# EAGLE board AI Camera V1.0 (EAGLE 9.6.2)
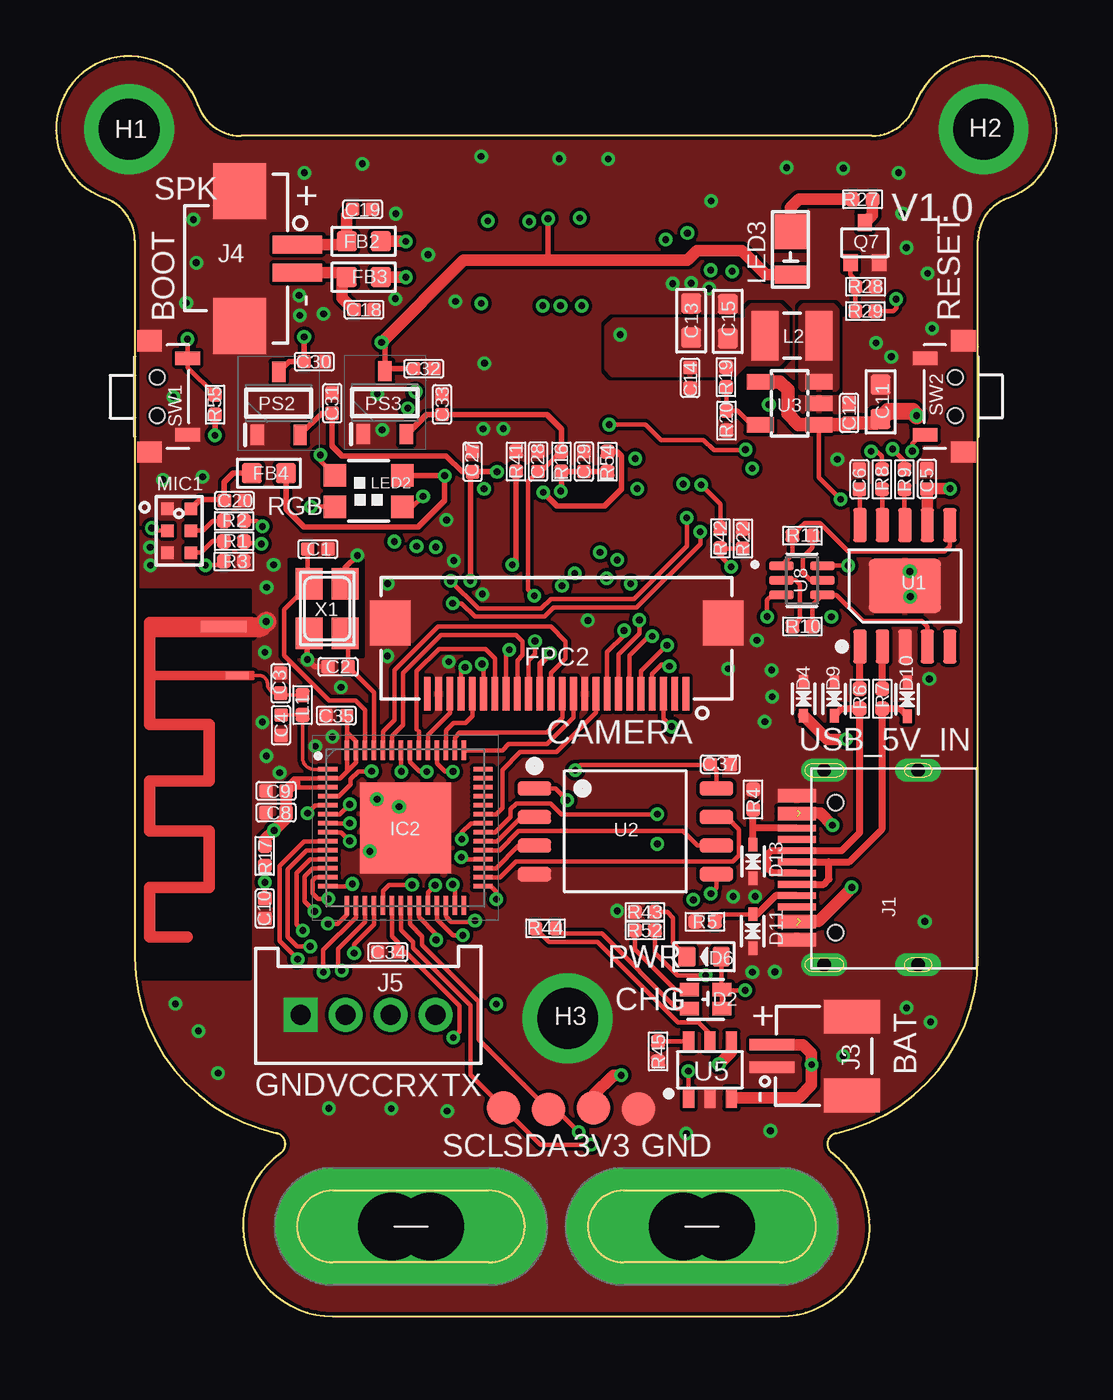
[diagram p2: board, top side]
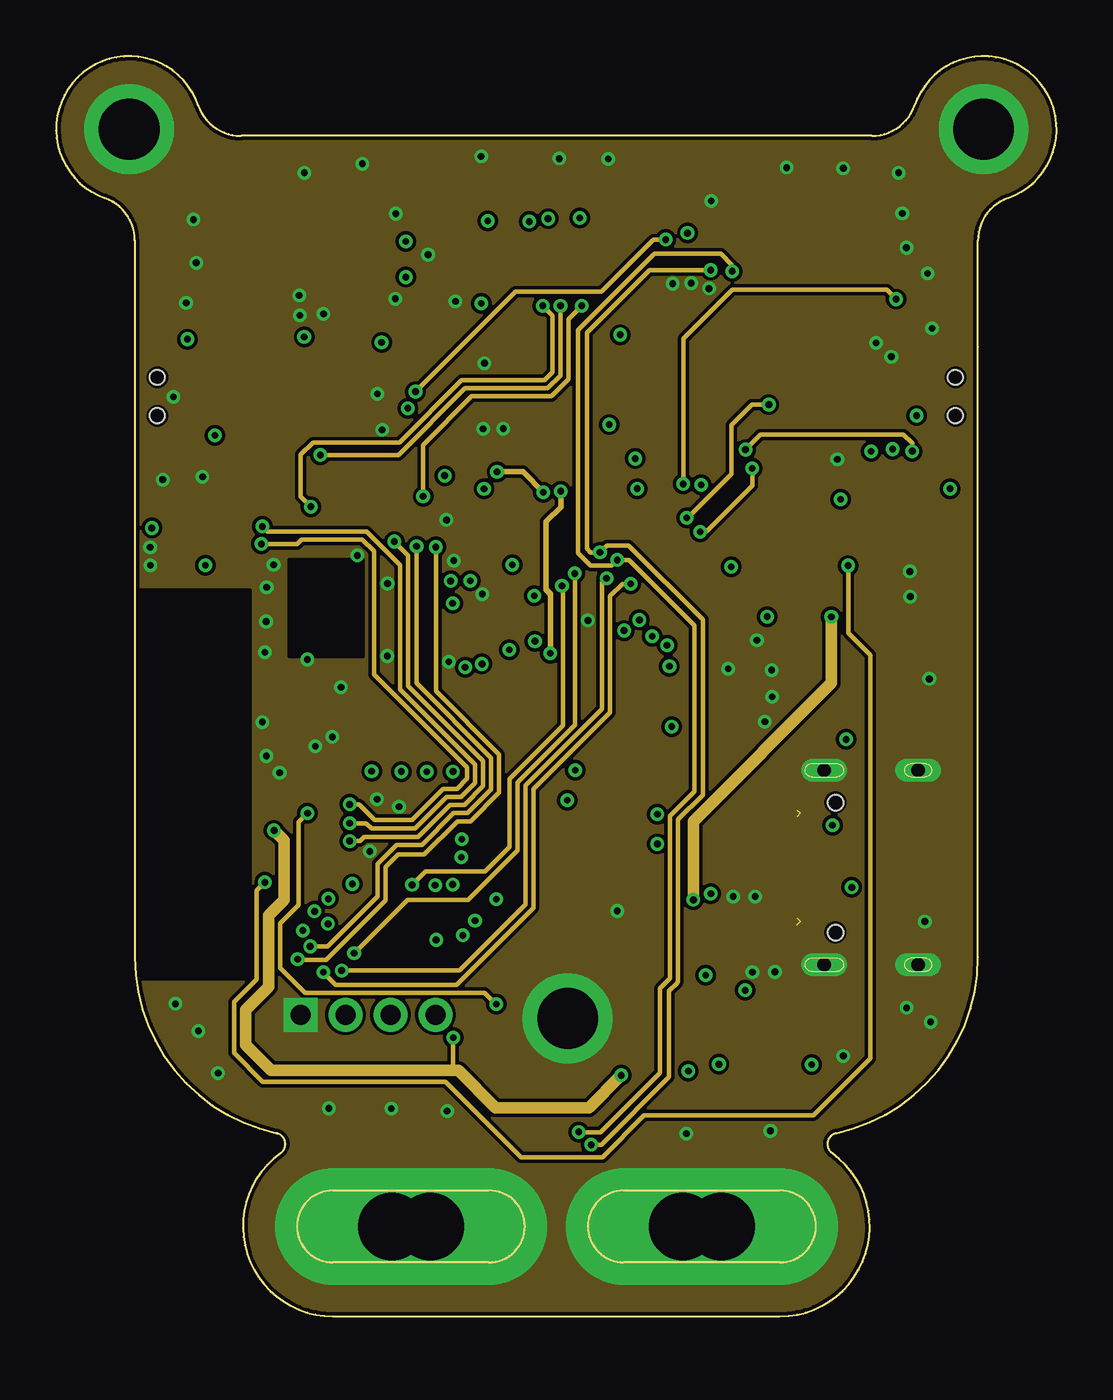
[diagram p3: board, inner layer Route2]
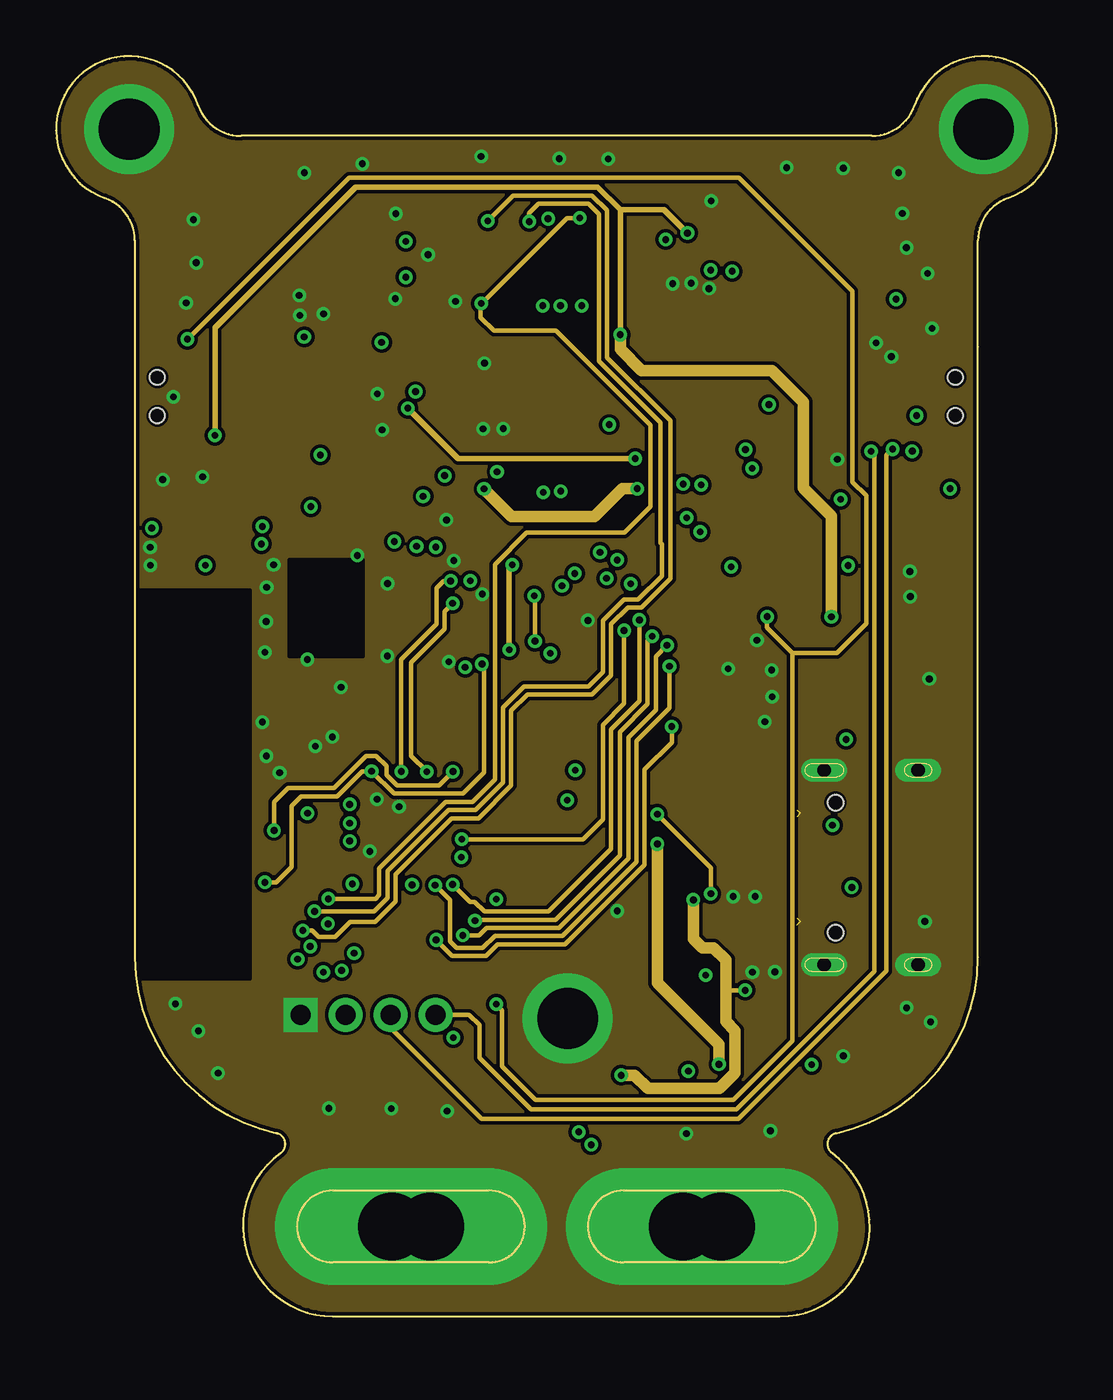
[diagram p4: board, inner layer Route15]
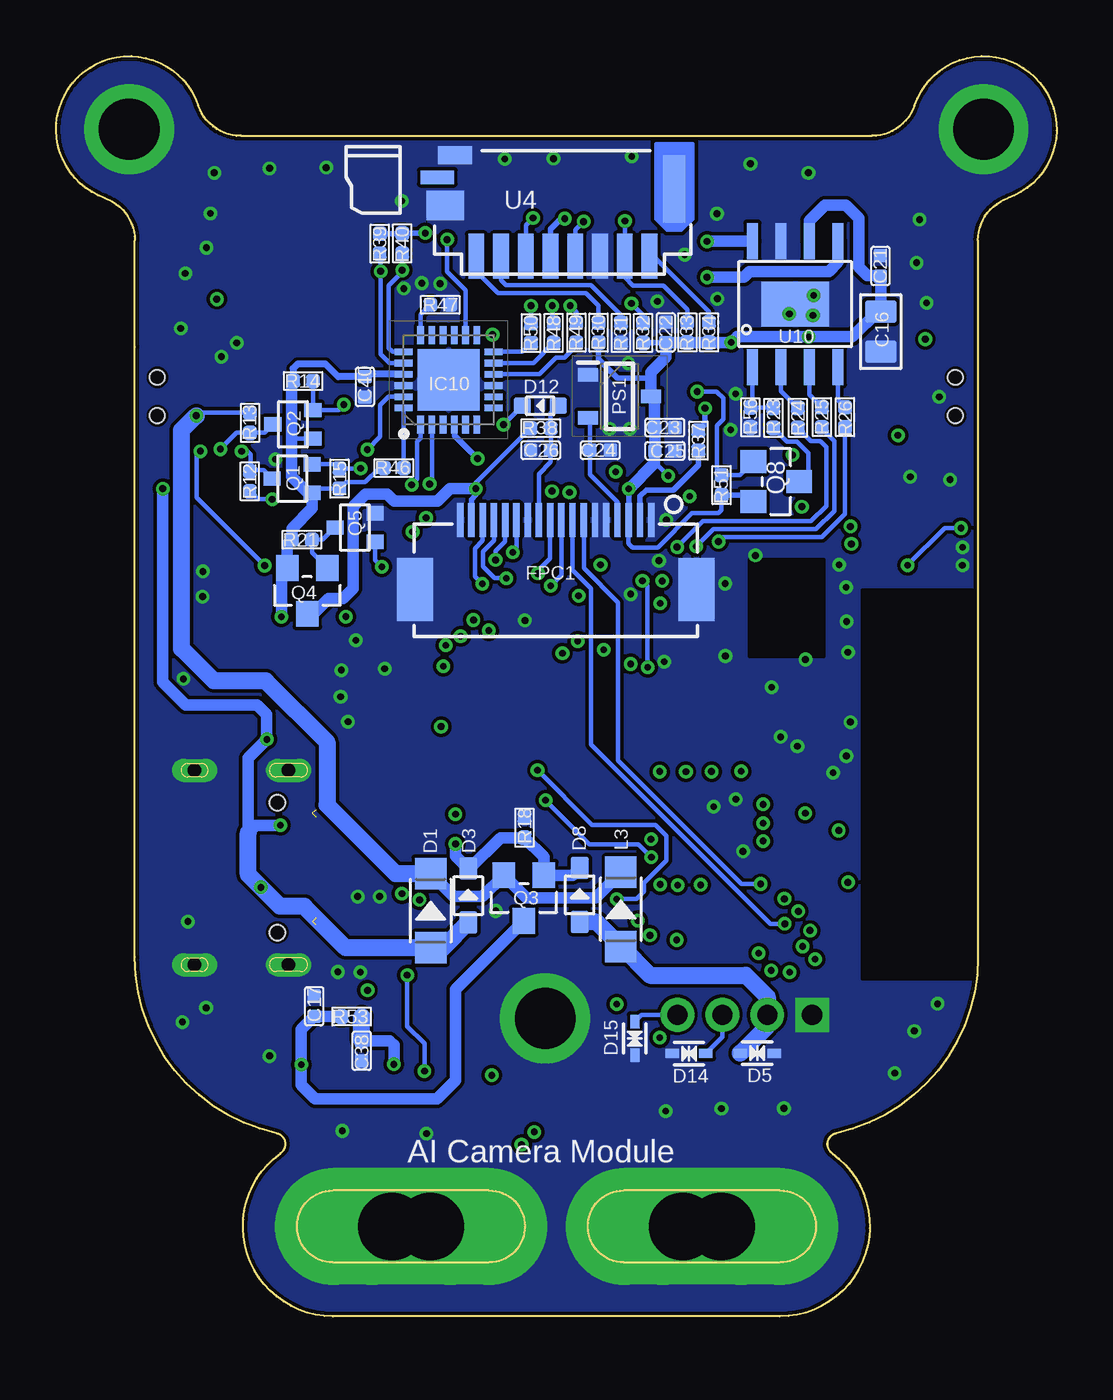
[diagram p5: board, bottom side, seen from below]

Size 44.5 x 56.05 mm. Coordinates in mm from the lower left corner, seen from the top.
Outline: 3.5,38.71 arc90 3.5,38.71
Outline: 3.5,43.11 arc90 3.5,43.11
Outline: 41,43.11 arc90 41,43.11
Outline: 12.31,0 32.19,0 arc144 34.52,7.25 arc-132 34.7,8.15 arc78 41,15.96 41,47.85 arc-71 42.33,49.73 arc232 38.18,53.85 arc-71 36.28,52.5 8.22,52.5 arc-71 6.32,53.85 arc232 2.17,49.73 arc-71 3.5,47.85 3.5,15.96 arc78 9.8,8.15 arc-132 9.98,7.25 arc144 12.31,0
Copper layers (1+2*15+16): Top 0.035mm / dielectric 1.5mm / Route2 0.035mm / dielectric 0.15mm / Route15 0.035mm / dielectric 0.2mm / Bottom 0.035mm
Design rules "default *": minimum track width 8mil, minimum drill 0.3mm, track to track 6mil, track to pad 6mil, pad to pad 4mil, via to via 6mil, smd to smd 6mil, copper to edge 6mil, drill to drill 4mil, minimum pad ring 6mil, minimum via ring 6mil, stop-mask expansion 4mil, vias tented up to drill 100mil, thermal gap 0mil

## Footprints (pad centres in the part's own frame; a part is rotated, then mirrored left to right if it is on the bottom)
ADAFRUIT_RN-ANT = smd 1 x 0.3: 1 0.5,2.159 | smd 2.032 x 0.508: GND 1.1,0
C0402 = smd 0.6 x 0.6: 1 -0.45,0; 2 0.45,0
C0603 = smd 0.889 x 0.889: 1 -0.762,0; 2 0.762,0
C0805 = smd 1.016 x 1.397: 1 -0.889,0; 2 0.889,0
D_SOD123FL = smd 1.397 x 1.397: + -1.651,0; - 1.651,0
LED_KT-0603RYG = smd 0.85 x 0.6: 1 0.725,-0.425; 2 0.725,0.425; 3 -0.725,-0.425; 4 -0.725,0.425
D_SOD323 = smd 1 x 0.8: + -1.2,0; - 1.2,0
SOD-523_L1.2-W0.8-LS1.6-BI = smd 0.6 x 0.4: 1 -0.75,0; 2 0.75,0
LED0603 = smd 0.762 x 0.889: + -0.762,0; - 0.762,0
D_SOD523 = smd 0.762 x 0.7: + -0.8,0; - 0.8,0
L0603 = smd 0.889 x 0.889: 1 -0.762,0; 2 0.762,0
FPC-SMD_18P-P0.50_ZX-0.5FPC-2H-HFJ18P = smd 0.28 x 1.5: 1 4.25,1.54; 2 3.75,1.54; 3 3.25,1.54; 4 2.75,1.54; 5 2.25,1.54; 6 1.75,1.54; 7 1.25,1.54; 8 0.75,1.54; 9 0.25,1.54; 10 -0.25,1.54; 11 -0.75,1.54; 12 -1.25,1.54; 13 -1.75,1.54; 14 -2.25,1.54; 15 -2.75,1.54; 16 -3.25,1.54; 17 -3.75,1.54; 18 -4.25,1.54 | smd 1.6 x 2.8: 19 -6.25,-1.54; 20 6.25,-1.54
FPC-SMD_P0.50-24P_QCHF-SM-H2.0 = smd 0.3 x 1.5: 1 5.75,-1.574; 2 5.25,-1.574; 3 4.75,-1.574; 4 4.25,-1.574; 5 3.75,-1.574; 6 3.25,-1.574; 7 2.75,-1.574; 8 2.25,-1.574; 9 1.75,-1.574; 10 1.25,-1.574; 11 0.75,-1.574; 12 0.25,-1.574; 13 -0.25,-1.574; 14 -0.75,-1.574; 15 -1.25,-1.574; 16 -1.75,-1.574; 17 -2.25,-1.574; 18 -2.75,-1.574; 19 -3.25,-1.574; 20 -3.75,-1.574; 21 -4.25,-1.574; 22 -4.75,-1.574; 23 -5.25,-1.574; 24 -5.75,-1.574 | smd 1.8 x 2: 25 7.4,1.576; 26 -7.4,1.576
HOLE_M2 = drill 2.7 pad 4: 1 0,0
LONGSTRIPHOLE = drill 3 pad 5.2 long: 1 -0.86,0; 2 0.86,0
QFN40P700X700X90-57N = smd 0.85 x 0.2: 1 -3.45,2.6; 2 -3.45,2.2; 3 -3.45,1.8; 4 -3.45,1.4; 5 -3.45,1; 6 -3.45,0.6; 7 -3.45,0.2; 8 -3.45,-0.2; 9 -3.45,-0.6; 10 -3.45,-1; 11 -3.45,-1.4; 12 -3.45,-1.8; 13 -3.45,-2.2; 14 -3.45,-2.6; 29 3.45,-2.6; 30 3.45,-2.2; 31 3.45,-1.8; 32 3.45,-1.4; 33 3.45,-1; 34 3.45,-0.6; 35 3.45,-0.2; 36 3.45,0.2; 37 3.45,0.6; 38 3.45,1; 39 3.45,1.4; 40 3.45,1.8; 41 3.45,2.2; 42 3.45,2.6 | smd 0.2 x 0.85: 15 -2.6,-3.45; 16 -2.2,-3.45; 17 -1.8,-3.45; 18 -1.4,-3.45; 19 -1,-3.45; 20 -0.6,-3.45; 21 -0.2,-3.45; 22 0.2,-3.45; 23 0.6,-3.45; 24 1,-3.45; 25 1.4,-3.45; 26 1.8,-3.45; 27 2.2,-3.45; 28 2.6,-3.45; 43 2.6,3.45; 44 2.2,3.45; 45 1.8,3.45; 46 1.4,3.45; 47 1,3.45; 48 0.6,3.45; 49 0.2,3.45; 50 -0.2,3.45; 51 -0.6,3.45; 52 -1,3.45; 53 -1.4,3.45; 54 -1.8,3.45; 55 -2.2,3.45; 56 -2.6,3.45 | smd 4.05 x 4.05: 57 0,0
QFN50P400X400X80-25N = smd 0.8 x 0.3: 1 -2,1.25; 2 -2,0.75; 3 -2,0.25; 4 -2,-0.25; 5 -2,-0.75; 6 -2,-1.25; 13 2,-1.25; 14 2,-0.75; 15 2,-0.25; 16 2,0.25; 17 2,0.75; 18 2,1.25 | smd 0.3 x 0.8: 7 -1.25,-2; 8 -0.75,-2; 9 -0.25,-2; 10 0.25,-2; 11 0.75,-2; 12 1.25,-2; 19 1.25,2; 20 0.75,2; 21 0.25,2; 22 -0.25,2; 23 -0.75,2; 24 -1.25,2 | smd 2.75 x 2.75: 25 0,0
USB-3.0TYPEC-SMD = smd 0.3 x 1.7: A1 -3.35,0.5; A4 -2.55,0.5; A5 -1.25,0.5; A6 -0.25,0.5; A7 0.25,0.5; A8 1.25,0.5; A9 2.55,0.5; A12 3.35,0.5; B1 3.05,0.5; B4 2.25,0.5; B5 1.75,0.5; B6 0.75,0.5; B7 -0.75,0.5; B8 -1.75,0.5; B9 -2.25,0.5; B12 -3.05,0.5 | drill 0.6 pad 1.016 long: P$1 -4.325,-0.72; P$2 4.325,-0.72; P$3 -4.325,-4.9; P$4 4.325,-4.9 | hole 0.68: -2.89,-1.22; 2.89,-1.22
CONN-SMD_2P-P1.00_XUNPU_WAFER-SH1.0-2PWB = smd 0.5 x 2: 1 -0.5,1.85; 2 0.5,1.85 | smd 1.5 x 2.5: 3 1.75,-1.7; 4 -1.75,-1.7
CONN-SMD_2P-P1.25-HC-1.25-2PWT = smd 0.8 x 2.2: 1 -0.625,1.285; 2 0.625,1.285 | smd 2.5 x 2.35: 3 -3.005,-1.285; 4 3.005,-1.285
CONN-TH_4P-P2.00_HCTL_HC-HY-4A = drill 0.9 pad 1.5 square: 1 3,0 | drill 0.9 pad 1.5: 2 1,0; 3 -1,0; 4 -3,0
L0402 = smd 0.635 x 0.635: 1 -0.445,0; 2 0.445,0
IND-SMD_L2.5-W2.0_MHCHL2520 = smd 1.2 x 2.2: 1 -1.2,0; 2 1.2,0
LED-SMD_4P-L3.2-W2.7-BL_A-SP1553R6GHB1C-A01-2T = smd 1 x 1: 1 -1.5,-0.7; 2 -1.5,0.7; 3 1.5,0.7; 4 1.5,-0.7
LED_3014_SMT = smd 0.8 x 1.4: 1 1.085,0 | smd 1.57 x 1.4: 2 -0.83,0
MIC-SMD_6P-L2.8-W1.9-P0.98-TL = smd 0.55 x 0.55: 1 -0.525,0.98; 2 -0.525,0; 3 -0.525,-0.98; 4 0.525,0.98; 5 0.525,0; 6 0.525,-0.98
TEST_PAD-1.5MM = smd 1.5 x 1.5: P$1 0,0
SOT95P280X130-3N = smd 0.9 x 0.6: 1 -1.4,0.95; 2 -1.4,-0.95; 3 1.4,0
MOS_SOT323 = smd 0.635 x 0.762: 1 -0.635,-0.889; 2 0.635,-0.889; 3 0,0.889
PMOS_SOT23 = smd 1.016 x 1.143: 1 -0.889,-1.016; 2 0.889,-1.016; 3 0,1.016
R0402 = smd 0.635 x 0.635: 1 -0.445,0; 2 0.445,0
KEY-SMD_4P-L4.6-W2.4_TSC01A-TDW1FH3.5 = smd 0.6 x 1.1: 1 -1.7,-0.85; 2 1.7,-0.85 | smd 0.95 x 1.1: 3 2.475,0.85; 4 -2.475,0.85 | hole 0.65: 0.85,0.5; -0.85,0.5
ESOP-10-EP-150MIL = smd 1.5 x 0.6: 1 -2.7,2; 2 -2.7,1; 3 -2.7,0; 4 -2.7,-1; 5 -2.7,-2; 6 2.7,-2; 7 2.7,-1; 8 2.7,0; 9 2.7,1; 10 2.7,2 | smd 2.4 x 3.2: EP 0,0
CKP_W25QXX-SOP-8-208MIL = smd 1.5 x 0.635: 1 -4.05,1.905; 2 -4.05,0.635; 3 -4.05,-0.635; 4 -4.05,-1.905; 5 4.05,-1.905; 6 4.05,-0.635; 7 4.05,0.635; 8 4.05,1.905
IC_SOT23-5 = smd 0.69 x 1.2: 1 -0.95,-1.3; 2 0,-1.3; 3 0.95,-1.3; 4 0.95,1.3; 5 -0.95,1.3
TF-SMD_HYCW104-TF08-375B = smd 0.7 x 2: 1 -3.53,-2.45; 2 -2.43,-2.45; 3 -1.33,-2.45; 4 -0.23,-2.45; 5 0.87,-2.45; 6 1.97,-2.45; 7 3.07,-2.45; 8 4.17,-2.45 | smd 1.5 x 0.6: 9 -5.27,1.06 | smd 1.5 x 0.8: 10 -4.48,2.05 | smd 1.65 x 1.3: 11 -4.91,-0.19 | smd 1 x 3: 12 5.27,0.55
SOT23-6L = smd 0.5 x 0.9: 1 -0.961,-1.212; 2 -0.011,-1.212; 3 0.94,-1.212; 4 0.94,1.288; 5 -0.011,1.288; 6 -0.961,1.288
SOP65P210X100-6N = smd 1.09 x 0.4: 1 -0.92,0.65; 2 -0.92,0; 3 -0.92,-0.65; 4 0.92,-0.65; 5 0.92,0; 6 0.92,0.65
NS4168-ESOP-8 = smd 1.6 x 0.5: 1 -2.8,1.905; 2 -2.8,0.635; 3 -2.8,-0.635; 4 -2.8,-1.905; 5 2.8,-1.905; 6 2.8,-0.635; 7 2.8,0.635; 8 2.8,1.905 | smd 2 x 3: 9 0,0
ADAFRUIT_NX3225 = smd 1.4 x 1.2: 1 -1.1,-0.8; 2 1.1,-0.8; 3 1.1,0.8; 4 -1.1,0.8

## Placement (x,y rotation side)
ANT1  ADAFRUIT_ANTENNA  [ADAFRUIT_RN-ANT]  8.56,30.66 180 top
C1  12pF  [C0402]  11.64,34.12 180 top
C2  12pF  [C0402]  12.54,28.89 0 top
C3  NC  [C0402]  9.98,28.16 90 top
C4  NC  [C0402]  10,26.29 270 top
C5  100nF  [C0402]  38.73,37.25 90 top
C6  1uF  [C0402]  35.73,37.23 90 top
C8  10uF  [C0402]  9.78,22.4 180 top
C9  100nF  [C0402]  9.78,23.37 0 top
C10  100nF  [C0402]  9.28,18.14 90 top
C11  22uF  [C0603]  36.67,40.67 270 top
C12  100nF  [C0402]  35.27,40.18 90 top
C13  22uF  [C0603]  28.24,44.28 270 top
C14  100nF  [C0402]  28.2,41.74 270 top
C15  22uF  [C0603]  29.87,44.25 270 top
C16  47uF  [C0805]  7.82,43.8 270 bottom
C17  10uF  [C0402]  33.02,13.79 270 bottom
C18  1nF/NC  [C0402]  13.69,44.77 180 top
C19  1nF/NC  [C0402]  13.63,49.24 0 top
C20  100nF  [C0402]  7.93,36.28 0 top
C21  100nF  [C0402]  7.84,46.72 90 bottom
C22  1uF  [C0402]  17.38,43.76 270 bottom
C23  1uF  [C0402]  17.43,39.53 0 bottom
C24  1uF  [C0402]  20.3,38.52 0 bottom
C25  100nF  [C0402]  17.42,38.49 180 bottom
C26  1uF  [C0402]  22.95,38.52 0 bottom
C27  100nF  [C0402]  18.52,38.01 90 top
C28  100nF  [C0402]  21.44,38.02 90 top
C29  100nF  [C0402]  23.47,38.02 90 top
C30  1uF  [C0402]  11.48,42.46 0 top
C31  1uF  [C0402]  12.28,40.61 90 top
C32  1uF  [C0402]  16.35,42.15 0 top
C33  1uF  [C0402]  17.16,40.56 90 top
C34  100nF  [C0402]  14.75,16.2 0 top
C35  100nF  [C0402]  12.46,26.72 180 top
C37  100nF  [C0402]  29.54,24.55 180 top
C38  1uF  [C0402]  30.91,11.81 90 bottom
C40  100nF  [C0402]  30.77,41.34 90 bottom
D1  DSS34  [D_SOD123FL]  27.84,18.04 90 bottom
D2  KT-0603RYG  [LED_KT-0603RYG]  28.89,14.1 0 top
D3  1N5817WS  [D_SOD323]  26.17,18.71 90 bottom
D4  LESD5D5.0CT1G-ES  [SOD-523_L1.2-W0.8-LS1.6-BI]  33.24,27.47 270 top
D5  LESD5D5.0CT1G-ES  [SOD-523_L1.2-W0.8-LS1.6-BI]  13.32,11.7 180 bottom
D6  Red  [LED0603]  28.82,15.99 180 top
D8  1N5817WS  [D_SOD323]  21.22,18.74 90 bottom
D9  LESD5D5.0CT1G-ES  [SOD-523_L1.2-W0.8-LS1.6-BI]  34.61,27.46 270 top
D10  LESD5D5.0CT1G-ES  [SOD-523_L1.2-W0.8-LS1.6-BI]  37.85,27.45 270 top
D11  LESD5D5.0CT1G-ES  [SOD-523_L1.2-W0.8-LS1.6-BI]  30.99,17.13 90 top
D12  B5819WT  [D_SOD523]  22.97,40.5 180 bottom
D13  LESD5D5.0CT1G-ES  [SOD-523_L1.2-W0.8-LS1.6-BI]  31,20.23 90 top
D14  LESD5D5.0CT1G-ES  [SOD-523_L1.2-W0.8-LS1.6-BI]  16.35,11.69 0 bottom
D15  LESD5D5.0CT1G-ES  [SOD-523_L1.2-W0.8-LS1.6-BI]  18.76,12.36 90 bottom
FB2  1K/500mA  [L0603]  13.68,47.81 180 top
FB3  1K/500mA  [L0603]  13.68,46.22 180 top
FB4  0R/800mA  [L0603]  9.46,37.5 0 top
FPC1  ZX-0.5FPC-2H-HFJ18P  [FPC-SMD_18P-P0.50_ZX-0.5FPC-2H-HFJ18P]  22.28,33.87 0 bottom
FPC2  AFC24-S24FIA-00  [FPC-SMD_P0.50-24P_QCHF-SM-H2.0]  22.26,29.26 0 top
H1  HOLE  [HOLE_M2]  3.25,52.8 0 top
H2  HOLE  [HOLE_M2]  41.25,52.8 0 top
H3  HOLE  [HOLE_M2]  22.75,13.25 0 top
H4  HOLE1  [LONGSTRIPHOLE]  15.78,4 0 top
H5  HOLE1  [LONGSTRIPHOLE]  28.72,4 0 top
IC2  ESP32-S3R8  [QFN40P700X700X90-57N]  15.53,21.72 0 top
IC10  AW9523BTQR  [QFN50P400X400X80-25N]  27.04,41.65 90 bottom
J1  TYPEC-3.0-16P-SMD  [USB-3.0TYPEC-SMD]  33.44,19.96 90 top
J3  ZX-SH1.0-2PLT1  [CONN-SMD_2P-P1.00_XUNPU_WAFER-SH1.0-2PWB]  33.69,11.58 90 top
J4  HC-1.25-2PWT  [CONN-SMD_2P-P1.25-HC-1.25-2PWT]  9.45,47.04 270 top
J5  HC-HY-4A-M  [CONN-TH_4P-P2.00_HCTL_HC-HY-4A]  13.87,13.41 180 top
L1  0R  [L0402]  10.96,27.19 270 top
L2  FTC252012S2R2MBCA  [IND-SMD_L2.5-W2.0_MHCHL2520]  32.73,43.61 180 top
L3  C15957_100Ω@100MHz  [D_SOD123FL]  19.38,18.1 90 bottom
LED2  A-SP1553R6GHB1C-A01-2T  [LED-SMD_4P-L3.2-W2.7-BL_A-SP1553R6GHB1C-A01-2T]  13.9,36.71 0 top
LED3  3014_LED  [LED_3014_SMT]  32.66,47.41 270 top
MIC1  LMD2718T261-OA1  [MIC-SMD_6P-L2.8-W1.9-P0.98-TL]  5.47,34.94 0 top
P1  TEST_PADPAD-1.5MM  [TEST_PAD-1.5MM]  23.9,9.28 180 top
P2  TEST_PADPAD-1.5MM  [TEST_PAD-1.5MM]  25.9,9.22 180 top
P3  TEST_PADPAD-1.5MM  [TEST_PAD-1.5MM]  21.9,9.21 180 top
P4  TEST_PADPAD-1.5MM  [TEST_PAD-1.5MM]  19.9,9.27 180 top
PS1  XC6206P182MR  [SOT95P280X130-3N]  19.44,40.92 0 bottom
PS2  XC6206P282MR  [SOT95P280X130-3N]  9.9,40.61 90 top
PS3  XC6206P182MR  [SOT95P280X130-3N]  14.62,40.64 90 top
Q1  BSS138W_SOT323  [MOS_SOT323]  34,37.26 90 bottom
Q2  BSS138W_SOT323  [MOS_SOT323]  33.97,39.67 90 bottom
Q3  AO3401  [PMOS_SOT23]  23.7,18.6 180 bottom
Q4  AO3401  [PMOS_SOT23]  33.33,32.26 180 bottom
Q5  SS8050W-SOT323  [MOS_SOT323]  31.21,35.08 90 bottom
Q7  SS8050W-SOT323  [MOS_SOT323]  35.97,47.75 0 top
Q8  AO3401  [PMOS_SOT23]  12.47,37.13 270 bottom
R1  0R  [R0402]  7.91,34.47 0 top
R2  0R  [R0402]  7.91,35.38 0 top
R3  NC  [R0402]  7.9,33.58 0 top
R4  5.1K  [R0402]  31,22.99 90 top
R5  5.1K  [R0402]  28.86,17.55 180 top
R6  0R  [R0402]  35.74,27.47 270 top
R7  0R  [R0402]  36.74,27.47 270 top
R8  0R  [R0402]  36.73,37.23 270 top
R9  0R  [R0402]  37.73,37.23 270 top
R10  10K  [R0402]  33.19,30.68 0 top
R11  10K  [R0402]  33.19,34.72 180 top
R12  4.7K  [R0402]  35.89,37.14 90 bottom
R13  4.7K  [R0402]  35.88,39.74 270 bottom
R14  4.7K  [R0402]  33.52,41.6 0 bottom
R15  4.7K  [R0402]  31.9,37.26 90 bottom
R16  0R  [R0402]  22.47,38.02 90 top
R17  10K  [R0402]  9.28,20.48 270 top
R18  10K  [R0402]  23.67,21.73 90 bottom
R19  45.3K  [R0402]  29.8,41.77 270 top
R20  10K  [R0402]  29.82,39.84 270 top
R21  10K  [R0402]  33.57,34.54 180 bottom
R22  10K  [R0402]  30.54,34.59 90 top
R23  1K  [R0402]  12.6,39.96 270 bottom
R24  0R  [R0402]  11.51,39.96 270 bottom
R25  0R  [R0402]  10.44,39.99 270 bottom
R26  0R  [R0402]  9.41,39.99 270 bottom
R27  100R  [R0402]  35.87,49.68 180 top
R28  10K  [R0402]  36,45.79 0 top
R29  100R  [R0402]  35.99,44.71 180 top
R30  10K  [R0402]  20.37,43.75 270 bottom
R31  10K  [R0402]  19.38,43.74 270 bottom
R32  10K  [R0402]  18.39,43.74 270 bottom
R33  10K  [R0402]  16.43,43.76 270 bottom
R34  10K  [R0402]  15.46,43.76 270 bottom
R37  0R  [R0402]  15.93,38.95 270 bottom
R38  10K  [R0402]  22.95,39.5 180 bottom
R39  4.7K  [R0402]  30.11,47.71 270 bottom
R40  4.7K  [R0402]  29.11,47.72 270 bottom
R41  1K  [R0402]  20.46,38.02 90 top
R42  100R  [R0402]  29.54,34.6 270 top
R43  5.1K  [R0402]  26.19,17.98 180 top
R44  2K  [R0402]  21.76,17.26 0 top
R45  2K  [R0402]  26.77,11.78 90 top
R46  0R  [R0402]  29.48,37.73 0 bottom
R47  0R  [R0402]  27.41,44.99 0 bottom
R48  1K  [R0402]  22.37,43.74 90 bottom
R49  1K  [R0402]  21.36,43.75 90 bottom
R50  1K  [R0402]  23.38,43.73 90 bottom
R51  10K  [R0402]  14.9,36.97 270 bottom
R52  5.1K  [R0402]  26.19,17.17 180 top
R53  5.1K  [R0402]  31.36,13.33 0 bottom
R54  0R/NC  [R0402]  24.52,38.01 90 top
R55  10K  [R0402]  7.06,40.55 90 top
R56  100K  [R0402]  13.62,39.98 90 bottom
SW1  TSC01A-TDW1EH3.5  [KEY-SMD_4P-L4.6-W2.4_TSC01A-TDW1FH3.5]  5,40.91 90 top
SW2  TSC01A-TDW1EH3.5  [KEY-SMD_4P-L4.6-W2.4_TSC01A-TDW1FH3.5]  39.5,40.91 270 top
U1  CH340K  [ESOP-10-EP-150MIL]  37.75,32.49 90 top
U2  W25Q128JVSIQ  [CKP_W25QXX-SOP-8-208MIL]  25.32,21.57 0 top
U3  RY3430  [IC_SOT23-5]  32.62,40.61 90 top
U4  TF-027-H300  [TF-SMD_HYCW104-TF08-375B]  22.28,49.6 0 bottom
U5  TP4059-SOT23-6  [SOT23-6L]  29.09,10.93 0 top
U8  UMH3NTN  [SOP65P210X100-6N]  33.17,32.74 0 top
U10  NS4168-ESOP-8  [NS4168-ESOP-8]  11.63,45.02 90 bottom
X1  40MHz(10ppm)  [ADAFRUIT_NX3225]  12.06,31.47 270 top

## Tracks (layer width: path | path; a pad name or v marks a point on that pad's centre or on a via)
1V8
  Bottom 0.203: FPC1.4 19.53,36.22 20.75,37.44 C24.1 20.75,39.88 PS1.2
3V3  (via drill 0.3)
  Top 0.254: 10.21,37.51 FB4.2 10.22,35.9 11.02,35.1 16.09,35.1 17.28,36.29 v17.28,37.39 15.42,37.39 LED2.3 15.1,37.71 | PS2.3 10.35,42.46 C30.1 v11.03,43.56 | C32.1 14.73,42.15 PS3.3 14.62,43.17 v14.47,43.32 | v21.88,48.82 21.88,46.98 21.87,46.97
  Top 0.508: 14.58,42 PS3.3 | C32.1 | LED3.1 31.57,46.32 30.51,47.39 28.5,47.39 28.08,46.97 21.87,46.97 18.13,46.97 v14.47,43.32
  Route15 0.508: v25.84,36.81 25.19,36.81 23.95,35.57 20.26,35.57 v19.03,36.8
  Bottom 0.203: v25.84,36.81 25.84,37.05 R38.2 | v17.28,37.39 17.84,37.95 17.88,37.95 | 19.03,35.68 19.04,35.67 19.04,34.38 18.86,34.2 17.74,34.2 16.21,35.73 15.04,35.73 14.9,35.87 R51.2
  Bottom 0.254: FPC1.3 19.03,35.68 v19.03,36.8 19.03,36.83 | C25.2 | 17.88,40.76 PS1.3 | FPC1.17 26.03,36.33 25.84,36.52 v25.84,36.81 | Q8.2 13.77,36.53 R51.2 | R30.2 20.37,42.57 19.53,41.73 18.04,41.73 | R32.2 17.39,43.29 C22.2 | U4.4 22.51,48.35 22.04,48.82 v21.88,48.82
  Bottom 0.381: R33.2
  Bottom 0.508: C22.2 17.37,42.67 18.04,42 18.04,41.73 PS1.3 | C22.2 17.4,43.32 | U10.6 10.99,48.72 10.3,49.42 9.37,49.42 8.79,48.84 8.79,46.66 8.41,46.28 C21.1 7.82,46.25 C16.1 7.95,44.69 9.07,43.56 v11.03,43.56 v11.03,43.57 14.22,43.57 v14.47,43.32 R34.2 R33.2 C22.2 | Q4.3 33.08,31.24 32.39,31.93 31.73,31.93 31.3,32.36 31.3,36.01 30.73,36.58 29.78,36.58 29.46,36.26 27.53,36.26 26.98,36.81 v25.84,36.81 | v19.03,36.8 17.88,37.95 C25.2 | C25.2 C23.1 17.88,40.76
3V3_1  (via drill 0.3)
  Top 0.203: 10.79,23.92 IC2.2 12.63,23.92 12.96,24.26 | 10.79,23.92 10.59,23.92 | 10.59,23.92 10.58,23.92 10.39,23.73 | 10.39,23.73 10.23,23.57 C9.2 | IC2.3 10.76,23.52 | 10.76,23.52 10.61,23.52 | 10.61,23.52 10.38,23.52 C9.2 | 10.79,23.92 10.76,23.89 10.76,23.69 | 10.76,23.69 10.76,23.67 | 10.76,23.67 10.76,23.52 | 10.59,23.92 10.61,23.9 10.61,23.52 | 10.76,23.69 10.44,23.69 10.39,23.73 | C9.2 10.46,23.37 10.76,23.67 | 12.96,24.26 13.33,24.63 IC2.55 13.33,25.56 12.93,25.96 | 12.96,24.26 12.93,24.28 IC2.56 12.93,25.96 | v17.65,24.23 17.3,24.23 16.93,24.59 IC2.46 | D2.2 29.58,14.56 D6.+ | D2.2 D2.1 | IC2.20 14.93,16.9 15.2,16.64 C34.2 15.55,16.2 17.94,13.81 17.94,12.67 v17.66,12.39 | D2.2 29.64,14.5 v30.65,14.5 | 12.93,25.96 12.93,26.69 C35.1
  Top 0.254: v7.06,39.18 R55.1
  Top 0.508: R17.1 9.28,21.2 v9.69,21.61 10.23,22.15 C8.1 C9.2 | D6.+ 29.61,15.96 | v25.13,10.72 24.78,10.72 23.9,9.84 P1.P$1
  Route2 0.203: 17.5,10.94 17.46,10.98 17.66,11.18 v17.66,12.39
  Route2 0.508: v9.69,21.61 10.14,21.16 10.14,18.52 9.45,17.83 9.45,14.65 8.42,13.62 8.42,12.08 9.56,10.94 17.5,10.94 17.89,10.94 19.55,9.28 23.69,9.28 v25.13,10.72 | v28.34,18.52 28.34,22.02 34.48,28.16 v34.48,31.11
  Route15 0.203: v9.69,21.61 9.69,22.87 10.31,23.49 12.36,23.49 13.79,24.92 14.24,24.92 14.69,24.47 14.69,24.08 15.17,23.61 17.03,23.61 v17.65,24.23 | v30.65,14.5 29.78,14.5
  Route15 0.254: v25.09,43.66 25.09,49.22 | v7.06,39.18 7.06,43.98 13.31,50.23 24.08,50.23 25.09,49.22 | v28.08,48.18 27.04,49.22 25.09,49.22
  Route15 0.508: v28.34,18.52 28.34,16.79 28.74,16.39 29.24,16.39 29.78,15.85 29.78,14.5 29.78,13.11 30.19,12.7 30.19,10.82 29.51,10.14 26.31,10.14 25.73,10.72 v25.13,10.72 | v34.48,31.11 34.48,35.59 33.24,36.84 33.24,40.66 31.84,42.06 26.04,42.06 25.09,43.01 v25.09,43.66
  Bottom 0.203: Q2.1 34.01,39.03 34.03,39.05 | 33.03,36.7 32.92,36.82 R15.1 31.61,37.1 30.75,37.1 30.12,37.73 R46.1
  Bottom 0.254: 32.04,36.67 R15.1 | 33.03,36.7 Q1.1 | R39.1 R40.1 28.1,48.16 v28.08,48.18
  Bottom 0.305: IC10.21 30.66,41.9 C40.2 31.95,41.79 32.52,42.36 33.76,42.36 33.96,42.16 R14.1
  Bottom 0.508: v34.48,31.11 34.48,33.01 Q4.2 34.22,34.33 R21.2 | R14.1 34.03,41.53 34.03,39.05 34.03,37.35 33.3,36.62 Q1.1 33.11,35.94 34.01,35.03 R21.2 | R21.2 33.99,34.56
  pour Top: 24.75,41.87 30.17,41.87 30.66,42.36 32.14,42.36 32.53,42.75 32.53,44.61 32.17,44.97 30.94,44.97 30.73,44.76 30.73,44.42 30.65,44.34 24.81,44.34 24.48,44.01 24.48,42.14
CAM_1V8  (via drill 0.3)
  Top 0.203: 21.5,37.57 C28.1 | 22.39,38.46 R16.2 22.15,38.15 22.14,38.15 21.56,37.57 C28.1 | FPC2.15 21.01,29.16 21.3,29.45 v21.3,30.03 | C28.1 20.99,37.12 20.99,32.32 v21.26,32.05
  Top 0.254: R16.2 22.47,39.47 21.83,40.11 C33.1 16.47,40.11 15.6,39.24 PS3.2
  Route15 0.203: v21.3,30.03 21.3,32.01 v21.26,32.05
CAM_2V8  (via drill 0.3)
  Top 0.203: FPC2.21 18.01,28.69 v18.19,28.87 | 18.52,37.49 C27.1
  Top 0.254: PS2.2 11.8,40.16 C31.1 12.28,38.7 12.71,38.27 17.35,38.27 18.06,37.56 C27.1 | R54.2 24.94,38.45 25.14,38.25 25.14,36.8 24.38,36.04 22.27,36.04 v21.67,36.64 | C27.1 18.42,37.46 v18.42,32.71 | v19.61,37.56 C27.1
  Route2 0.254: v19.61,37.56 20.75,37.56 v21.67,36.64
  Bottom 0.203: v18.42,32.71 18.19,32.48 v18.19,28.87
CC1
  Top 0.203: R5.1 29.63,17.88 D11.2
  Top 0.305: J1.A5 32,18.71 31.17,17.88 D11.2
CC2
  Top 0.305: D13.2 31,21.71 | 31,21.71 R4.1 | 31,21.71 J1.B5
DOVDD  (via drill 0.3)
  Top 0.203: C29.1 | R54.1
  Top 0.254: FPC2.14 21.51,29.02 v21.98,29.49 | v22.44,36.7 22.47,36.73 R16.1 C29.1 | C29.1 R54.1
  Route2 0.254: v21.98,29.49 21.98,32.13 21.79,32.32 21.79,35.35 22.44,36 v22.44,36.7
DTR
  Top 0.203: R10.2 33.63,31.63 U8.4 34.71,32.09 35.88,30.92 38.5,30.92 38.75,30.67 U1.4
ESP32_EN  (via drill 0.3)
  Top 0.203: C10.2 v9.28,19.3 R17.2 9.32,20.04 9.33,20.02 | v14.03,24.24 13.45,24.24 13.1,23.89 13.1,23.66 12.56,23.12 IC2.4 | U8.6 v35.23,33.39 | FPC2.19 19.01,28.94 v18.94,29.01 | v38.08,38.48 38.08,38.81 38.48,39.21 SW2.2 | v30.66,38.55 30.63,38.52 29.26,38.52 28.8,38.98 26.89,38.98 26.21,39.66 v24.6,39.66
  Route2 0.203: v35.23,33.39 35.23,30.39 36.21,29.41 36.21,11.47 33.67,8.93 26.15,8.93 24.29,7.07 20.68,7.07 17.32,10.43 9.19,10.43 7.91,11.71 7.91,13.98 8.91,14.98 8.91,18.93 v9.28,19.3 | v38.08,38.48 38.08,38.83 37.69,39.22 31.33,39.22 v30.66,38.55
  Route15 0.203: v9.28,19.3 9.78,19.3 10.47,19.99 10.47,22.69 10.9,23.12 12.49,23.12 13.61,24.24 v14.03,24.24 15.02,23.25 18.09,23.25 19.02,24.18 19.02,28.93 v18.94,29.01
  Bottom 0.203: 23.63,40.64 D12.- v24.6,39.66 | v38.08,38.48 38.25,38.48 38.25,36.41 v35.23,33.39 | v30.66,38.55 30.09,39.12 30.09,40.53 29.72,40.9 IC10.23
ESP_RXD0  (via drill 0.3)
  Top 0.203: IC2.50 15.33,24.24 v15.35,24.23 | v28.05,35.51 28.05,34.26 25.69,31.9 22,31.9 21.57,31.47 18.78,31.47 v17.54,32.7
  Route2 0.203: v31.7,40.55 30.94,40.55 30.03,39.64 30.03,37.46 28.08,35.51 v28.05,35.51
  Route15 0.203: v17.54,32.7 17.22,32.7 16.91,32.39 16.91,30.78 15.34,29.21 v15.34,24.24 v15.35,24.23
  Bottom 0.203: Q2.2 32.92,40.14 | Q2.2 R14.2 | Q2.2 31.94,40.3 v31.7,40.55
ESP_TXD0  (via drill 0.3)
  Top 0.203: IC2.49 15.73,24.66 16.17,24.22 v16.49,24.22 | v17.63,31.71 18.04,31.71 18.63,31.11 21.72,31.11 22.13,31.52 25.82,31.52 28.65,34.36 v28.65,34.89
  Route2 0.203: v28.65,34.89 28.9,34.89 30.96,36.95 v30.96,37.71
  Route15 0.203: v16.49,24.22 15.79,24.92 15.79,29.09 17.27,30.57 17.27,31.35 v17.63,31.71
  Bottom 0.203: 32.06,37.86 R15.2 | Q1.2 32.1,37.9 R15.2 | R15.2 v30.96,37.7 v30.96,37.71
EX_AD0
  Bottom 0.203: R47.1 28.29,44.55 IC10.18
EX_AD1
  Bottom 0.203: R46.2 IC10.24
EX_P0_4_GLED
  Bottom 0.203: IC10.10 23.01,41.9 22.26,42.65 21.89,42.65 21.36,43.18 R49.1
EX_P0_5_RLED
  Bottom 0.203: IC10.11 23.26,42.4 R48.1
EX_P0_6_BLED
  Bottom 0.203: IC10.12 23.76,42.9 R50.1
EX_P1_0_PWR_EN  (via drill 0.3)
  Top 0.203: v28.69,36.98 29.54,36.13 R42.1
  Bottom 0.203: IC10.1 28.29,39.05 28.44,38.9 28.44,37.23 v28.69,36.98
EX_P1_1_BL  (via drill 0.3)
  Top 0.203: v37.36,45.24 37.36,44.84 37.23,44.71 R29.1
  Route2 0.203: v27.89,37.02 27.89,43.48 30.07,45.66 36.94,45.66 v37.36,45.24
  Bottom 0.203: IC10.2 27.79,37.12 v27.89,37.02
EX_P1_3_LED_K  (via drill 0.3)
  Route15 0.254: v15.64,40.39 17.88,38.15 v25.76,38.15
  Bottom 0.254: R37.1 15.64,39.68 v15.64,40.39 | v25.76,38.15 26.79,39.18 IC10.4
EX_P1_4_NS_CTRL  (via drill 0.3)
  Route2 0.203: v15.98,41.13 20.44,45.58 24.25,45.58 26.56,47.89 v27.11,47.89
  Bottom 0.203: v27.11,47.89 27.11,46.46 26.29,45.64 IC10.14 | v15.98,41.13 15.13,41.13 14.83,40.83 14.83,39.91 15.12,39.62 15.12,37.63 R51.1 14.09,37.41 Q8.1
GND  (via drill 0.3)
  Top 0.203: P2.P$1 25.9,8.7 | X1.2 11.32,30.31
  Top 0.254: X1.2 11.17,30.28 v11.17,29.21 11.49,28.89 C2.1 | X1.4 12.86,33.3 v13.4,33.84
  Top 0.889: ANT1.GND 9.1,30.66 v9.34,30.9
  other vias: 14.73,29.37 30.11,18.67 31.09,18.67 9.36,32.42 4.19,33.4 37.97,33.13 37.99,32.01 29.89,28.8 38.84,28.35 30.97,15.31 31.97,15.32 38.64,17.56 4.18,34.2 9.67,33.42 9.94,24.18 15.25,22.66 13.95,20.68 5.3,13.9 6.33,12.69 7.2,10.82 12.13,9.25 14.91,9.24 17.39,9.13 4.74,37.21 6.51,37.34 5.22,40.9 5.78,45.07 24.55,51.48 13.62,51.26 29.13,49.61 36.47,43.29 37.15,42.68 38.96,43.94 38.76,46.38 37.82,47.53 37.64,49.05 34.75,38.12 24.95,18.03 28.03,8.13 31.77,8.25 35.01,11.58 38.89,13.09 37.83,13.72 14.27,23 31.17,30.07 23.65,30.95 31.82,28.74 31.85,27.56 31.52,26.45 14.74,32.59 22.38,51.49 18.9,51.59 9.28,29.54 12.67,27.98 9.17,26.43 9.35,24.92 11.53,25.35 12.28,25.77 19.05,42.39 14.5,39.43 19.89,39.48 18.99,39.47 15.09,45.26 11.89,44.59 10.84,44.52 10.81,45.41 27.42,45.93 28.24,45.95 29.04,45.71 14.28,41.03 18.95,32.12 17.69,33.61 17.36,35.42 17.76,45.14 17.46,29.11 37.47,50.86 35.01,51.06 32.49,51.09 11.04,50.86 6.1,48.78 6.23,46.86 15.11,49.04 16.54,47.22
  pour Top (rank 2): -2.31,58 -2.31,-1 46.5,-1 46.5,58
  pour Bottom (rank 2): -3.5,59 -3.5,-2 47.5,-2 47.5,59
  cutout Bottom: 10.36,33.65 10.36,29.34 13.66,29.34 13.66,33.65
  cutout Route15: 10.36,33.65 10.36,29.34 13.66,29.34 13.66,33.65
  cutout Route2: 10.36,33.65 10.36,29.34 13.66,29.34 13.66,33.65
  cutout Top: 10.36,33.65 10.36,29.34 13.66,29.34 13.66,33.65
  cutout Route2: 3.41,32.3 3.41,15 3.41,15 8.62,15 8.62,32.3 3.42,32.3 3.41,32.3
  pour Route2: -4.5,60 -4.5,-3 48.5,-3 48.5,60
  cutout Route15: 3.41,32.3 3.41,15 3.41,15 8.62,15 8.62,32.3 3.41,32.3
  pour Route15: -5.5,61 -5.5,-4 49.5,-4 49.5,61
GND1
  cutout Bottom: 3.4,32.31 3.4,15.01 3.4,15.01 8.63,15.01 8.63,32.31 3.41,32.31 3.4,32.31
GND2
  cutout Top: 3.41,32.3 3.41,15 3.41,15 8.62,15 8.62,32.3 3.42,32.3 3.41,32.3
I46_CAM_D9
  Top 0.203: IC2.52 14.53,26 15.05,26.52 15.05,28.74 16.08,29.77 16.98,30.67 22,30.67 22.65,30.02 22.65,29.25 22.01,28.61 FPC2.13
IO0_BOOT  (via drill 0.3)
  Top 0.203: IC2.5 11.52,22.72 v11.18,22.38 | v31.62,31.12 31.62,31.85 31.86,32.09 U8.3 | R55.2 5.85,42.2 SW1.2 v5.84,43.46
  Route2 0.203: v11.18,22.38 10.78,21.98 10.78,18.29 9.96,17.47 9.96,15.5 11.07,14.39 19.06,14.39 v19.57,13.88
  Route15 0.203: 32.75,29.51 31.62,30.64 v31.62,31.12 | 32.75,29.51 32.75,12.26 30.12,9.63 21.32,9.63 19.84,11.11 19.84,13.61 v19.57,13.88 | 32.75,29.51 34.73,29.51 36.03,30.81 36.03,36.49 35.41,37.11 35.41,45.6 30.37,50.64 13.02,50.64 v5.84,43.46
IO1_MIC_CLK
  Top 0.203: MIC1.6 6.45,33.96 6.96,34.47 R1.1
IO2_MIC_DATA
  Top 0.203: MIC1.5 6.53,34.94 6.97,35.38 R2.1
IO3_SDATA  (via drill 0.3)
  Top 0.203: IC2.8 12.67,21.52 v13.05,21.14
  Route2 0.203: v13.05,21.14 13.51,21.14 13.7,21.33 16.11,21.33 17.52,22.74 18.16,22.74 19,23.58 19,24.69 15.66,28.03 15.66,33.84 v15.04,34.46
  Bottom 0.203: v15.04,34.46 14.84,34.66 10.43,34.66 9.41,35.68 R26.2
IO4_LRCLK  (via drill 0.3)
  Top 0.203: IC2.9 11.03,21.12 9.94,20.03 9.94,16.69 v10.74,15.89
  Route2 0.203: v10.74,15.89 10.76,15.86 12.01,15.86 14.66,18.5 14.66,19.98 15.21,20.54 16.37,20.54 17.85,22.02 18.44,22.02 19.71,23.29 19.71,24.99 16.89,27.8 16.89,34.21 v16.88,34.21
  Bottom 0.203: v16.88,34.21 15.73,35.37 10.92,35.37 10.25,36.04 10.25,38.67 10.52,38.94 10.93,38.94 R24.2
IO5_BCLK  (via drill 0.3)
  Top 0.203: v11.3,16.45 10.72,16.45 10.29,16.88 10.29,19.88 11.14,20.72 IC2.10
  Route2 0.203: v11.3,16.45 12.08,16.45 14.29,18.67 14.29,20.12 15.14,20.97 16.27,20.97 17.68,22.39 18.3,22.39 19.35,23.43 19.35,24.84 16.03,28.16 v16.03,34.25
  Bottom 0.203: 10.44,39.36 R25.2 10.44,39.48 9.89,38.93 9.89,35.83 10.7,35.01 15.27,35.01 v16.03,34.25
IO6_SD_MISO  (via drill 0.3)
  Top 0.203: v10.97,17.16 10.69,17.43 10.69,19.72 11.3,20.32 IC2.11
  Route15 0.203: v10.97,17.16 11.38,17.16 11.67,16.87 12.4,16.87 13.07,17.54 14.18,17.54 15.1,18.46 15.1,19.65 17.59,22.15 18.78,22.15 20.24,23.6 20.24,26.93 20.97,27.66 23.83,27.66 24.68,28.51 24.68,30.78 25.43,31.53 26.03,31.53 27.33,32.82 27.33,39.83 24.5,42.65 24.5,49.19 23.84,49.85 20.33,49.85 v19.2,48.72
  Bottom 0.203: R33.1 16.43,44.78 17.49,45.84 18.84,45.84 19.21,46.21 U4.7 v19.2,48.72
IO7_SD_CLK  (via drill 0.3)
  Top 0.203: IC2.12 11.4,19.92 11.05,19.57 11.05,18.45 v11.49,18.01
  Route15 0.203: v11.49,18.01 14.14,18.01 14.74,18.61 14.74,19.8 17.46,22.51 18.65,22.51 19.88,23.75 19.88,27.08 20.82,28.02 23.69,28.02 24.32,28.66 24.32,30.95 25.25,31.88 25.88,31.88 26.93,32.93 26.93,34.34 26.87,34.4 26.87,39.66 26.87,39.75 24.14,42.48 24.14,49.03 23.69,49.48 21.45,49.48 21.04,49.07 v21.04,48.69
  Bottom 0.203: U4.5 21.41,48.32 v21.04,48.69
IO8_SD_MOSI  (via drill 0.3)
  Top 0.203: IC2.13 11.53,19.52 11.41,19.4 11.41,18.8 11.64,18.57 v12.11,18.57
  Route15 0.203: v12.11,18.57 14.2,18.57 14.37,18.74 14.37,19.93 17.32,22.88 18.51,22.88 19.51,23.88 19.51,33.44 20.92,34.85 25.28,34.85 26.43,36 26.43,39.64 22.24,43.83 19.47,43.83 18.88,44.42 18.88,45.02 v18.91,45.05 22.71,48.85 v23.29,48.85
  Bottom 0.203: R32.1 18.39,44.53 v18.91,45.05 | v23.29,48.85 23.61,48.53 U4.3
IO9_LCD_D/C  (via drill 0.3)
  Top 0.203: v13.17,19.23 13.06,19.12 IC2.14
  Bottom 0.203: FPC1.7 21.03,33.27 19.51,31.75 19.51,24.73 14.01,19.23 v13.17,19.23
IO10_LCD_CS  (via drill 0.3)
  Top 0.203: v12.09,17.46 12.52,17.46 12.93,17.87 IC2.15
  Bottom 0.203: FPC1.8 21.53,33.2 20.71,32.38 20.71,25.42 12.74,17.46 v12.09,17.46
IO11_TP_INT  (via drill 0.3)
  Top 0.203: IC2.16 13.33,17.74 11.88,16.29 v11.88,15.3
  Route2 0.203: v11.88,15.3 12.44,14.75 17.81,14.75 21.23,18.16 21.23,23.46 24.64,26.87 24.64,32.03 25.19,32.58 v25.55,32.58
  Bottom 0.203: v25.55,32.58 25.88,32.91 25.88,34.16 25.53,34.5 FPC1.16
IO12_TP_TRST  (via drill 0.3)
  Top 0.203: v12.7,15.38 12.53,15.55 12.53,16.33 13.73,17.54 IC2.17
  Route2 0.203: v24.48,32.83 24.28,32.63 24.28,27.01 20.87,23.6 20.87,18.31 17.94,15.38 v12.7,15.38
  Bottom 0.203: FPC1.15 25.03,34.5 25.52,34.01 25.52,33.34 25.01,32.83 v24.48,32.83
IO13_LCD_MOSI  (via drill 0.3)
  Top 0.203: IC2.18 14.13,17.43 13.25,16.55 v13.25,16.15
  Route2 0.203: v13.25,16.15 15.62,18.52 18.32,18.52 20.52,20.72 20.52,23.75 23.07,26.31 v23.07,33.04
  Bottom 0.203: FPC1.10 22.53,33.7 23.07,33.16 v23.07,33.04
IO14_LCD_SCK  (via drill 0.3)
  Top 0.203: IC2.19 14.53,18.92 14.8,19.19 v15.83,19.19
  Route2 0.203: v22.5,32.49 22.54,32.45 22.54,26.28 20.16,23.9 20.16,20.87 19.07,19.78 16.42,19.78 v15.83,19.19
  Bottom 0.203: FPC1.9 22.03,32.96 v22.5,32.49
IO15_SCL  (via drill 0.3)
  Top 0.203: v23.8,7.63 21.54,7.63 P4.P$1 18.43,10.74 18.43,13.82 15.87,16.38 15.87,16.64 15.33,17.18 IC2.21
  Route2 0.203: v23.8,7.63 24.25,7.63 27.26,10.64 27.26,14.47 27.62,14.83 27.62,14.85 27.67,14.89 27.67,22.1 28.76,23.2 28.76,30.99 25.46,34.29 24.5,34.29 v24.19,33.98 23.77,33.98 23.6,34.15 23.6,43.74 26.39,46.53 v29.11,46.53
  Bottom 0.203: FPC1.13 24.03,34.14 v24.19,33.98 | IC10.19 29.54,42.9 29.71,43.07 29.71,45.83 29.11,46.43 v29.11,46.53 R40.2
IO16_SDA  (via drill 0.3)
  Top 0.203: IC2.22 15.73,17.45 16.28,16.91 16.28,16.51 18.79,14 18.79,12.32 P3.P$1 22.23,9.21 v23.24,8.2
  Route2 0.203: v23.24,8.2 v23.25,8.19 24.22,8.19 26.85,10.82 26.85,14.58 27.31,15.04 27.31,22.25 28.4,23.34 28.4,30.72 25.48,33.64 v24.96,33.64 24.71,33.39 23.76,33.39 23.21,33.94 23.21,43.86 26.61,47.26 29.56,47.26 30.07,46.75 v30.07,46.48
  Bottom 0.203: v24.96,33.64 24.96,34.03 24.53,34.46 FPC1.14 | IC10.20 29.66,42.4 30.07,42.81 v30.07,46.48 30.07,47.22 R39.2
IO17_CAM_D4  (via drill 0.3)
  Top 0.203: FPC2.3 27.01,26.6 v27.38,26.23 | IC2.23 16.13,17.75 16.9,16.99 v16.9,16.74
  Route15 0.203: v27.38,26.23 27.38,25.53 26.16,24.31 26.16,20.07 22.63,16.54 19.63,16.54 19.11,16.03 17.61,16.03 v16.9,16.74
IO18_CAM_D3  (via drill 0.3)
  Top 0.203: IC2.24 16.53,18.86 v16.86,19.18 | v27.28,28.91 27.21,28.98 26.92,28.98 26.51,28.58 FPC2.4
  Route15 0.203: v16.86,19.18 17.52,18.52 17.52,16.68 17.81,16.39 18.97,16.39 19.51,16.93 22.51,16.93 25.81,20.22 25.81,25.6 27.28,27.07 v27.28,28.91
IO19_CAM_D5  (via drill 0.3)
  Top 0.203: FPC2.5 26.01,28.69 v27.17,29.85 | v18.09,16.94 17.65,16.94 16.93,17.66 IC2.25
  Route15 0.203: v27.17,29.85 26.67,29.35 26.67,26.96 25.45,25.74 25.45,20.37 22.37,17.28 19.14,17.28 18.8,16.94 v18.09,16.94
IO20_CAM_D2  (via drill 0.3)
  Top 0.203: IC2.26 17.33,17.77 17.57,17.54 18.57,17.54 v18.63,17.6 | FPC2.6 25.51,29.39 26.37,30.25 v26.51,30.25
  Route15 0.203: v18.63,17.6 18.67,17.64 22.22,17.64 25.07,20.49 25.07,25.99 26.31,27.23 26.31,30.05 v26.51,30.25
IO21_CAM_D6  (via drill 0.3)
  Top 0.203: v17.63,19.2 17.73,19.1 IC2.27 | v25.94,30.97 25.94,30.36 25.01,29.43 FPC2.7
  Route15 0.203: v17.63,19.2 18.4,18.43 18.61,18.43 19.05,18 21.9,18 24.69,20.79 24.69,26.11 25.94,27.36 v25.94,30.97
IO38_CAM_D8
  Top 0.203: IC2.43 19.85,25.17 20.13,25.45 21.83,25.45 23.01,26.62 FPC2.11
IO39_CAM-MCLK
  Top 0.203: FPC2.12 22.51,26.64 21.84,25.97 17.95,25.97 17.73,25.75 IC2.44
IO40_CAM_SCL
  Top 0.203: FPC2.20 18.51,26.71 18.2,26.4 17.68,26.4 17.33,26.05 IC2.45
IO41_CAM_SDA
  Top 0.203: IC2.47 16.53,25.85 17.51,26.83 FPC2.22
IO42_CAM_VS
  Top 0.203: IC2.48 16.13,26.01 16.04,26.11 16.04,28.7 17.02,29.68 19.09,29.68 19.51,29.26 FPC2.18
IO45_CAM_HS
  Top 0.203: IC2.51 14.93,25.81 15.43,26.31 15.43,28.61 17.12,30.31 20.45,30.31 20.74,30.02 20.74,29.41 20.51,29.18 FPC2.16
IO47_CAM_D7
  Top 0.203: IC2.37 19.55,22.32 19.85,22.62 19.85,24.31 20.63,25.09 22.25,25.09 24.01,26.85 FPC2.9
IO48_CAM_PCLK  (via drill 0.3)
  Top 0.203: IC2.36 18.44,21.92 18.04,21.52 v18.04,21.22 | v25.26,30.5 25.26,30.29 24.51,29.54 FPC2.8
  Route15 0.203: v18.04,21.22 23.44,21.22 24.32,22.1 24.32,26.31 25.26,27.25 v25.26,30.5
LCD_RESET
  Bottom 0.203: 22.53,38.49 C26.2 R38.1 22.51,40.16 D12.+ | FPC1.11 23.03,37.47 22.51,37.99 C26.2
  Bottom 0.254: C26.2
LEDK
  Bottom 0.254: R37.2 15.93,37.87 17.04,36.76 18.25,36.76 18.53,36.48 FPC1.2
N$1  (via drill 0.3)
  Top 0.203: R1.2 8.42,34.4 9.13,34.4 v9.13,34.35 | v13.05,22.77 12.61,22.32 IC2.6
  Route2 0.203: v9.13,34.35 10.72,34.35 10.92,34.55 13.61,34.55 14.13,34.03 14.13,28.55 18.28,24.4 18.28,23.91 17.83,23.46 17.22,23.46 15.83,22.07 14.17,22.07 13.47,22.77 v13.05,22.77
N$2
  Bottom 0.203: U4.2 24.71,46.08 24.5,45.87 20.72,45.87 19.38,44.53 R31.1
N$3  (via drill 0.3)
  Top 0.203: MIC1.2 4.37,34.94 v4.25,35.06 | v6.63,33.4 7.28,33.4 R3.1
  Bottom 0.203: v4.25,35.06 4.97,35.06 v6.63,33.4
N$6
  Top 0.156: 8.08,28.48 arc-90 ANT1.1 arc-90 ANT1.1 9.03,28.5 arc-90 9.4,28.13 arc90 9.82,27.71 C3.1 arc90 10.06,27.63 L1.1
  Top 0.203: 8.08,28.48 arc-90 ANT1.1
N$7
  Top 0.156: 11.88,24.32 IC2.1 11.48,24.32 arc-90 10.96,24.85 L1.2 C4.1 arc90 C4.1
  Top 0.203: C4.1 arc-90 C4.1
N$8
  Top 0.203: R43.1 27.19,17.98 27.44,17.73 27.44,16.61 D6.-
N$9
  Top 0.203: R52.2 25.74,16.31 27.53,14.52 D2.4
N$10
  Top 0.305: R7.1 U1.2
N$11
  Top 0.305: R6.1 U1.1
N$12
  Top 0.203: U1.9 36.75,36.76 R8.2
N$13
  Top 0.203: U1.8 37.73,35.21 R9.2
N$14
  Top 0.203: R10.1 33.06,31 33.06,31.01 33.07,31.02 33.07,32.55 32.88,32.74 U8.2
N$15
  Top 0.203: U8.5 33.55,32.74 33.22,33.07 33.22,33.77 33.63,34.18 R11.1
N$16
  Top 0.203: U1.10 35.75,36.76 C6.1
N$17  (via drill 0.3)
  Top 0.203: IC2.7 v13.05,21.92 v13.05,21.93 | v9.17,35.13 8.92,35.38 R2.2
  Route2 0.203: v13.05,21.93 13.78,21.93 14.02,21.7 15.96,21.7 17.36,23.1 18.01,23.1 18.64,23.73 18.64,24.55 15.3,27.89 15.3,33.41 13.8,34.91 9.39,34.91 v9.17,35.13
N$18  (via drill 0.3)
  Top 0.203: R52.1 26.63,16.16 27.63,15.17 v28.89,15.17 | U5.1 v28.12,10.91
  Bottom 0.203: v28.12,10.91 28.12,12.13 28.89,12.9 v28.89,15.17
N$19
  pour Top: 33.24,41.19 34.63,41.19 34.74,41.3 34.75,41.31 34.75,43.77 34.75,44.76 34.61,44.9 34.54,44.97 33.48,44.97 33.26,44.97 33.1,44.81 33.1,41.31 33.22,41.19
N$20
  Top 0.203: X1.3 12.99,30.24 C2.2 14.13,27.74 IC2.53
N$21
  Top 0.203: R19.2 29.82,41.31 R20.1 | R20.1 29.99,40.28 | U3.5 30.93,39.66 30.3,40.28 R20.1
N$22
  Bottom 0.203: U10.2 12.26,41.16 R24.1
N$23
  Bottom 0.203: U10.3 10.99,40.99 R25.1
N$24
  Bottom 0.203: U10.4 9.72,40.75 R26.1
  Bottom 0.254: 9.71,42.2 U10.4
N$25
  Bottom 0.203: 33.1,34.52 R21.1 | 32.76,33.6 Q4.1 33.12,33.96 R21.1 | Q5.3 32.64,34.54 R21.1
N$26  (via drill 0.3)
  Top 0.203: R22.1 R42.2 29.54,33.82 v30.02,33.34
  Bottom 0.203: Q5.1 30.32,33.64 v30.02,33.34
N$27
  Top 0.203: R45.2 U5.6
N$28  (via drill 0.3)
  Top 0.508: FB3.1 v15.55,46.22
  Bottom 0.508: v15.55,46.22 13.9,46.22 13.66,46.46 10.14,46.46 9.72,46.87 U10.5
N$29  (via drill 0.3)
  Top 0.508: v15.55,47.81 FB2.1
  Bottom 0.508: U10.8 v15.54,47.82 v15.55,47.81
N$30
  Top 0.254: C20.1 7.48,36.32 | 7.48,36.32 7.48,37.1 7.88,37.5 FB4.1 | MIC1.4 6.39,36.32 7.48,36.32
N$31
  Top 0.508: R27.2 33.04,49.68 32.66,49.3 LED3.2
N$32
  Top 0.508: R27.1 36.31,48.98 Q7.3
N$33
  Top 0.203: R29.2 35.54,45.78 R28.1 35.56,46.1 35.33,46.33 Q7.1
N$34  (via drill 0.3)
  Top 0.203: LED2.2 11.75,38.06 v11.75,38.31
  Route2 0.203: v11.75,38.31 15.22,38.31 18.19,41.28 21.86,41.28 22.43,41.85 v22.43,44.94 v22.43,44.95
  Bottom 0.203: v22.43,44.95 22.43,44.24 R48.2
N$35
  Bottom 0.203: 20.37,44.34 R30.1 20.37,44.95 20.92,45.5 24.85,45.5 25.81,46.46 U4.1
N$36
  Top 0.203: C1.2 11.19,32.64 X1.1 10.13,31.44 10.13,29.39 12.13,27.39 13.31,27.39 13.73,26.96 IC2.54
N$38  (via drill 0.3)
  Top 0.203: 20.44,37.55 R41.1 | FPC2.17 20.01,29.51 v20.15,29.65
  Top 0.254: R41.1 20.46,33.59 v20.29,33.42
  Route15 0.254: v20.29,33.42 20.15,33.28 v20.15,29.65
N$39  (via drill 0.3)
  Top 0.203: LED2.1 v11.33,36.01
  Route2 0.203: v21.64,44.95 22.08,44.51 22.08,42 21.71,41.63 18.04,41.63 15.28,38.87 11.42,38.87 10.87,38.32 10.87,36.47 v11.33,36.01
  Bottom 0.203: R49.2 21.36,44.67 v21.64,44.95
N$40  (via drill 0.3)
  Top 0.203: LED2.4 15.86,36.01 v16.32,36.47
  Route2 0.203: v16.32,36.47 16.32,38.76 18.48,40.92 22.03,40.92 22.79,41.68 22.79,44.36 v23.38,44.95
  Bottom 0.203: v23.38,44.95 R50.2
N$42
  Bottom 0.203: U4.8 17.93,47.15 15.46,44.68 R34.1
N$43
  Top 0.203: R44.2 22.44,17.02 24.27,17.02 27.62,13.67 D2.3
N$44
  Top 0.203: R44.1 21.32,17.24 21.92,16.64 24.08,16.64 27.65,13.08 28.56,13.08 29.08,12.56 U5.5
NS_3V3
  Bottom 0.203: Q8.3 11.03,37.55 11.03,38.39 11.55,38.9 11.99,38.9 R23.2
NS_CTRL
  Bottom 0.203: R23.1 12.62,40.42 13.59,40.42 | 13.59,40.42 R56.2 | U10.1 13.53,40.48 13.59,40.42
  Bottom 0.254: U10.1 13.53,41.92
RTS
  Top 0.203: U8.1 32.74,33.89 R11.2 33.06,35.04 33.06,35.05 33.3,35.29 33.97,35.29 35.24,34.02 39.51,34.02 39.75,34.26 U1.6
RXD0_H  (via drill 0.3)
  Top 0.203: 37.68,37.72 R9.1 37.73,38.04 v37.2,38.57
  Route15 0.203: v37.2,38.57 v37.19,38.57 36.94,38.32 36.94,15.37 30.35,8.78 18.92,8.78 14.87,12.83 J5.3
  Bottom 0.203: v37.2,38.57 36.47,39.3 R13.2 35.23,39.3 Q2.3 | D14.2 14.87,12.42 J5.3
SPICLK
  Top 0.203: IC2.33 19.72,20.72 20.57,21.58 27.87,21.58 28.51,20.93 U2.6
SPICS0  (via drill 0.3)
  Top 0.203: IC2.32 18.12,20.32 v18.02,20.42 | v22.73,22.95 22.2,23.47 U2.1
  Bottom 0.203: v18.02,20.42 v18.03,20.42 18.6,20.99 20.77,20.99 v22.73,22.95
SPID  (via drill 0.3)
  Top 0.203: IC2.35 19.51,21.52 20.21,22.22 20.21,22.56 20.47,22.82 21.99,22.82 22.48,22.33 v26.74,22.33 | v29.12,18.8 29.37,19.05 U2.5
  Route15 0.203: v26.74,22.33 29.12,19.95 v29.12,18.8
SPIHD
  Top 0.203: U2.7 29.82,22.2 30.37,21.66 30.37,20.5 30.13,20.26 30.11,20.24 20.46,20.24 19.74,19.52 IC2.30
SPIQ
  Top 0.203: IC2.34 19.61,21.12 20.69,22.2 U2.2
SPIWP
  Top 0.203: U2.3 20.56,20.93 19.55,19.92 IC2.31
TXD0_H  (via drill 0.3)
  Top 0.203: R8.1 36.73,38.25 36.51,38.47 v36.25,38.47
  Route15 0.203: v36.25,38.47 36.4,38.32 36.4,15.33 30.27,9.2 21.12,9.2 18.82,11.5 18.82,12.96 18.37,13.41 J5.4
  Bottom 0.203: v36.25,38.47 35.98,38.47 35.84,38.33 35.84,37.63 | 35.84,37.63 R12.2 | Q1.3 35.26,37.63 35.84,37.63 | J5.4 18.46,13.41 D15.2
USB_D+
  Top 0.305: J1.A6 31.85,19.71 31.66,19.9 31.66,20.56 31.82,20.72 J1.B6 34.94,20.71 35.74,21.51 R6.2 34.92,27.03 D9.2
USB_D-
  Top 0.305: J1.A7 34.36,20.21 | 34.36,20.21 35.27,20.21 36.74,21.68 R7.2 37.52,27.03 D10.2 | J1.B7 34.14,19.21 34.38,19.45 34.38,20.19 34.36,20.21
VBAT  (via drill 0.3)
  Top 0.508: U5.3 33.03,9.72 33.6,10.29 v33.6,11.2 33.6,11.7 33.22,12.08 J3.2
  Bottom 0.508: R53.1 C17.2 33.6,12.76 v33.6,11.2 33.6,10.29 32.99,9.68 27.56,9.68 26.74,10.5 26.74,14.54 Q3.3
VBUS1  (via drill 0.3)  (4 unrouted)
  Top 0.508: 33.09,17.56 33.89,17.56 35.39,19.06 v35.39,19.08 | v35.13,25.66 34.3,25.66 D4.2 | v39.76,36.81 C5.1 38.75,36.78 U1.7 | 33.11,22.38 33.99,22.38 v34.53,21.84
  Bottom 0.508: v39.76,36.81 39.76,28.21 38.75,27.2 35.57,27.2 35.13,26.76 v35.13,25.66 35.96,24.83 35.96,21.5 35.62,21.84 v34.53,21.84
  Bottom 0.762: 35.96,21.5 35.96,19.65 v35.39,19.08 34.55,18.24 33.47,18.24 31.62,16.39 D1.+ 27.29,16.39 D3.+
VBUS2
  Bottom 0.762: D8.+ 20.47,17.54 L3.+ 19.36,16.45 18.08,15.17 13.83,15.17 12.87,14.21 J5.2 12.87,12.9 D5.2
VDD_SPI  (via drill 0.3)
  Top 0.203: IC2.29 19.34,19.12 19.57,18.9 v19.57,18.56 | v23.09,24.29 23.33,24.53 29.07,24.53 C37.2 29.37,24.27 U2.8
  Bottom 0.203: v19.57,18.56 18.69,18.56 18.36,18.89 18.36,19.28 17.36,20.28 17.36,21.37 17.85,21.86 20.66,21.86 v23.09,24.29
VIN  (via drill 0.3)
  Top 0.203: v34.89,36.34 33.92,37.31 U3.1
  Top 0.61: U3.4 32.2,41.56 32.54,41.22 32.54,40.14 33.02,39.66 U3.1 34.91,39.66 35.2,39.66 C12.1 36.49,39.73 C11.2
  Top 0.762: v38.27,40.06 38.09,40.24 37,40.24 C11.2
  Bottom 0.203: R13.1 38.14,40.18 v38.27,40.06 | R12.1 35.53,36.34 v34.89,36.34
  Bottom 0.508: L3.- 20.52,18.61 23.58,18.61 Q3.2 25.53,18.67 26.82,18.67 D1.-
  Bottom 0.762: D1.- 29.4,19.69 32.46,22.75 32.46,25.54 35.18,28.26 37.48,28.26 38.92,29.7 38.92,39.41 v38.27,40.06
VIN_C  (via drill 0.3)
  Top 0.508: U5.4 30.03,11.76 v29.48,11.21
  Route15 0.508: v26.74,21.01 26.74,14.84 29.48,12.1 v29.48,11.21
  Bottom 0.508: D8.- 21.54,19.62 Q3.1 22.81,20.43 R18.1 24.73,21.29 26.11,19.91 D3.- 26.74,20.48 v26.74,21.01 | v29.48,11.21 29.48,12.07 29.67,12.26 C38.2
  Bottom 0.762: C38.2 R53.2
VON
  Top 0.508: J4.2 12.72,46.41 | 12.72,46.41 FB3.2 | C18.2 12.72,45.29 12.72,46.41
VOP
  Top 0.508: J4.1 12.77,47.66 FB2.2 12.92,48.98 C19.1

## Text on the board
tPlace: SPK | + | V1.0 | - | BOOT | RESET | RGB | CAMERA | USB_5V_IN | PWR | CHG | + | BAT | GND | VCC | RX | TX | - | SCL | SDA | 3V3 | GND
bPlace: AI Camera Module
tNames: H1 | H2 | H3